# EAGLE schematic UCirKit30x20-0721 (EAGLE 7.3.0)
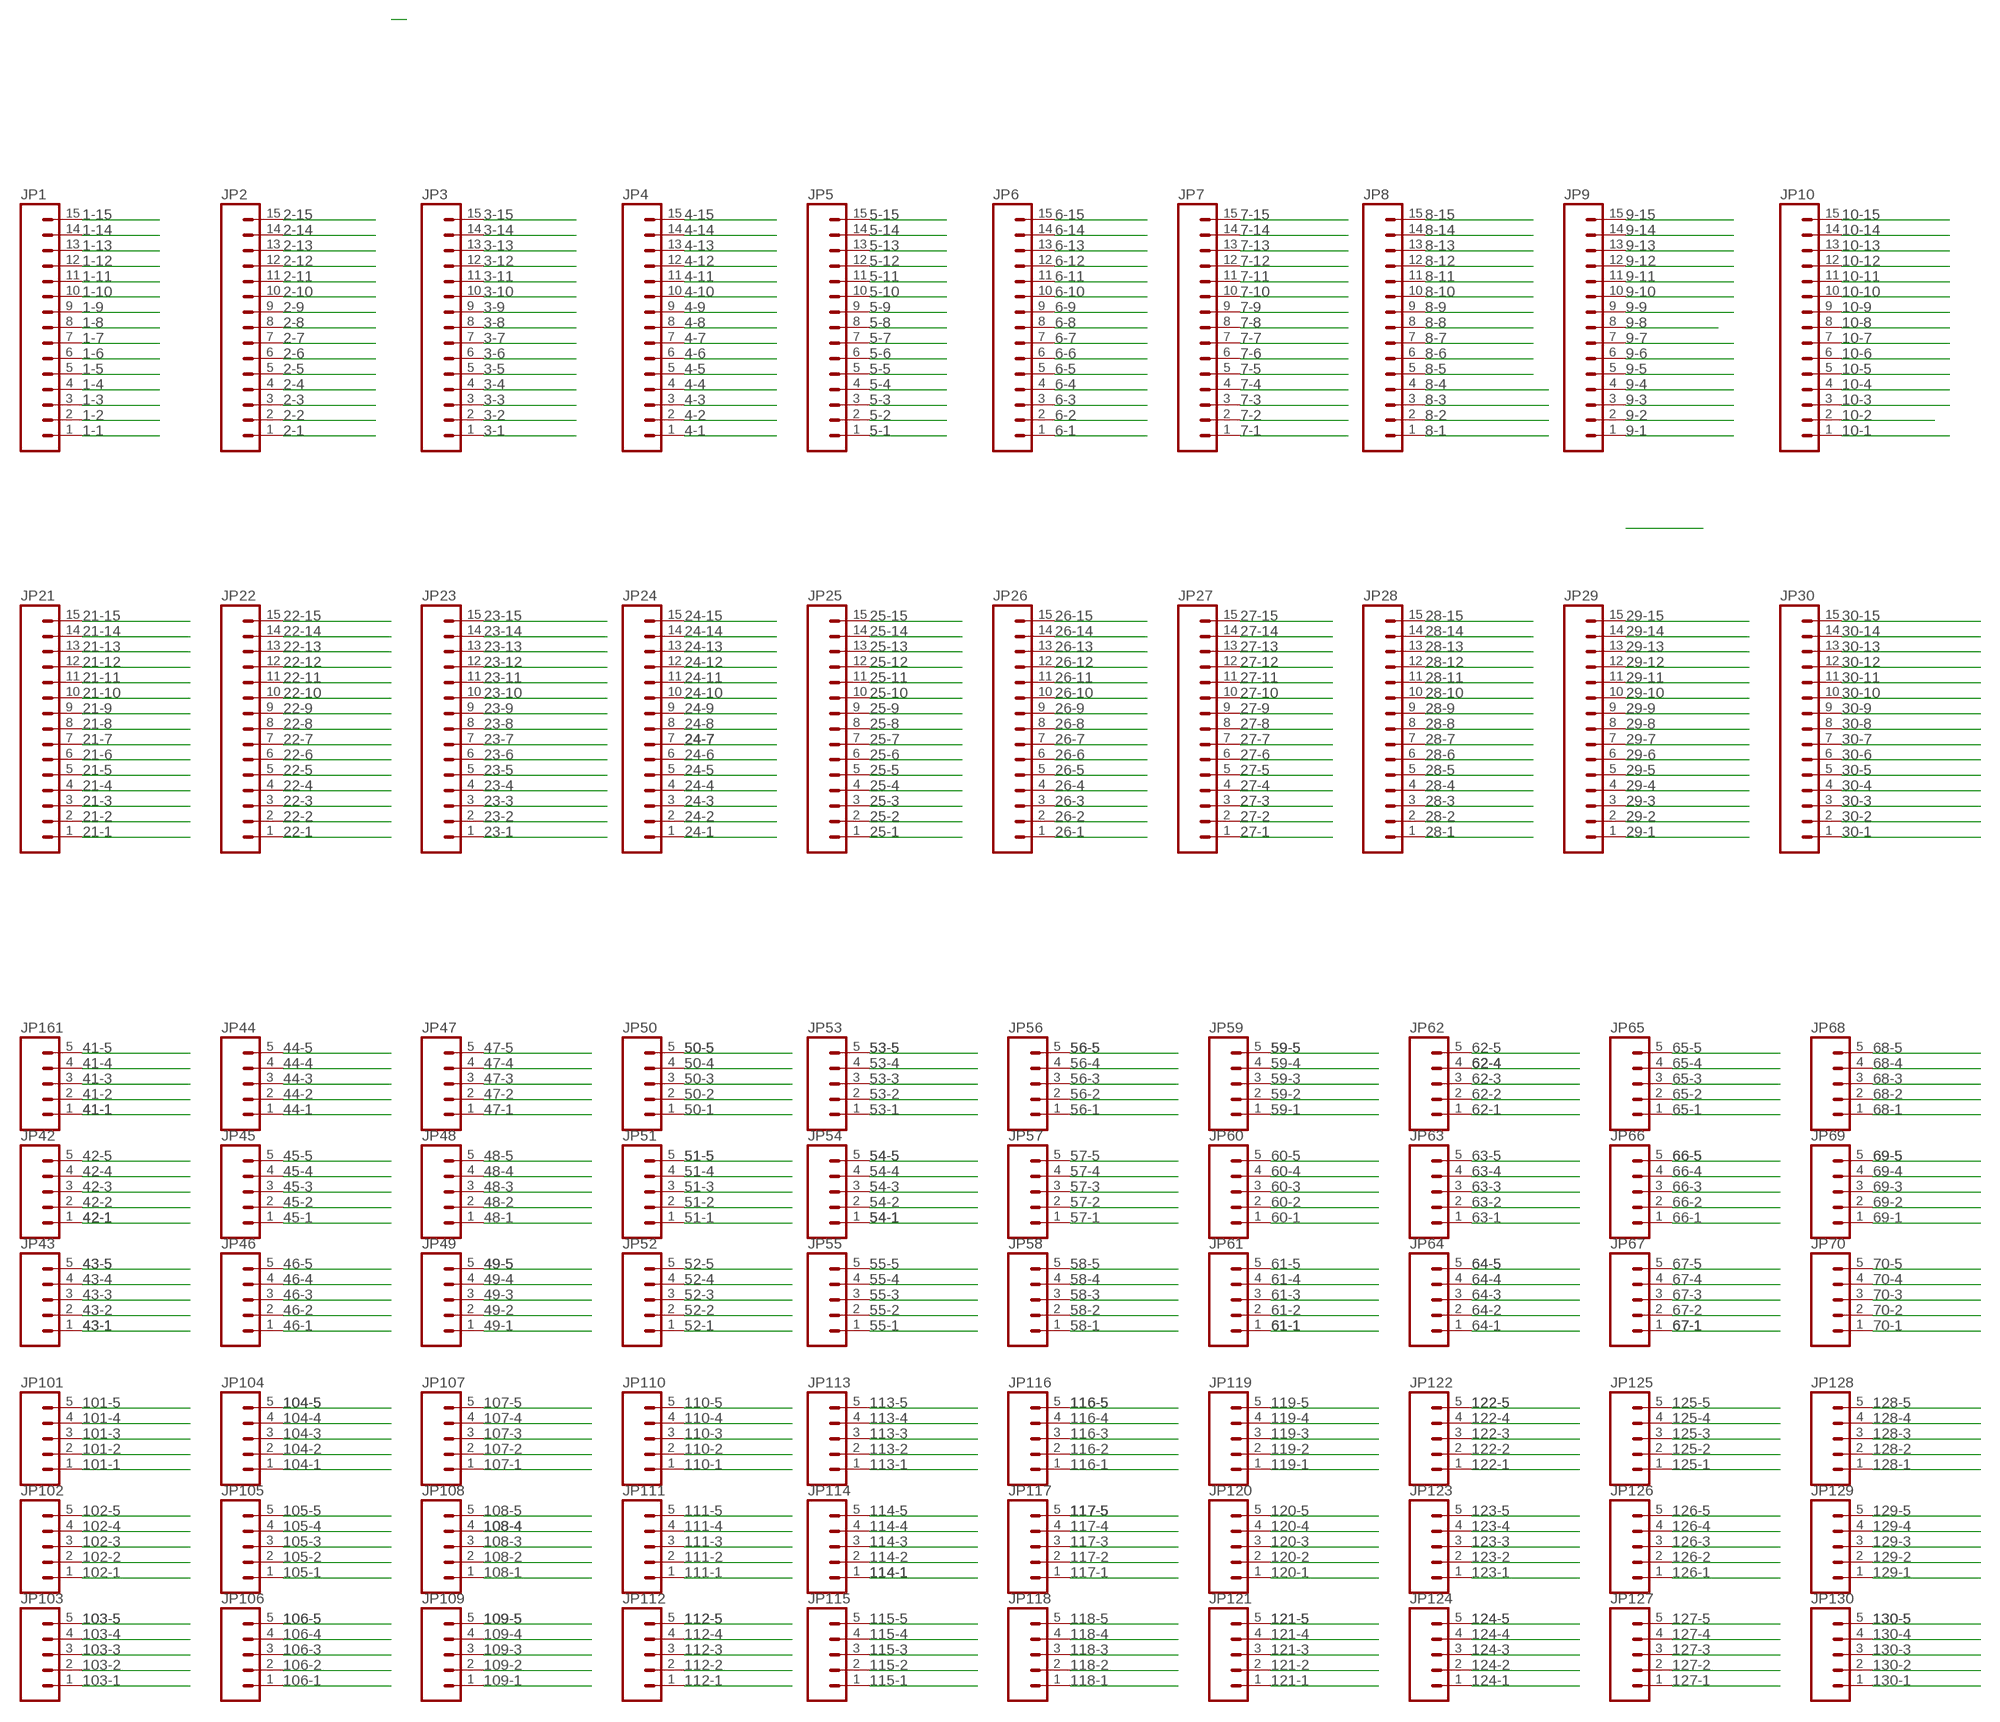
[diagram p0: schematic, sheet 1, part 1 of 2]
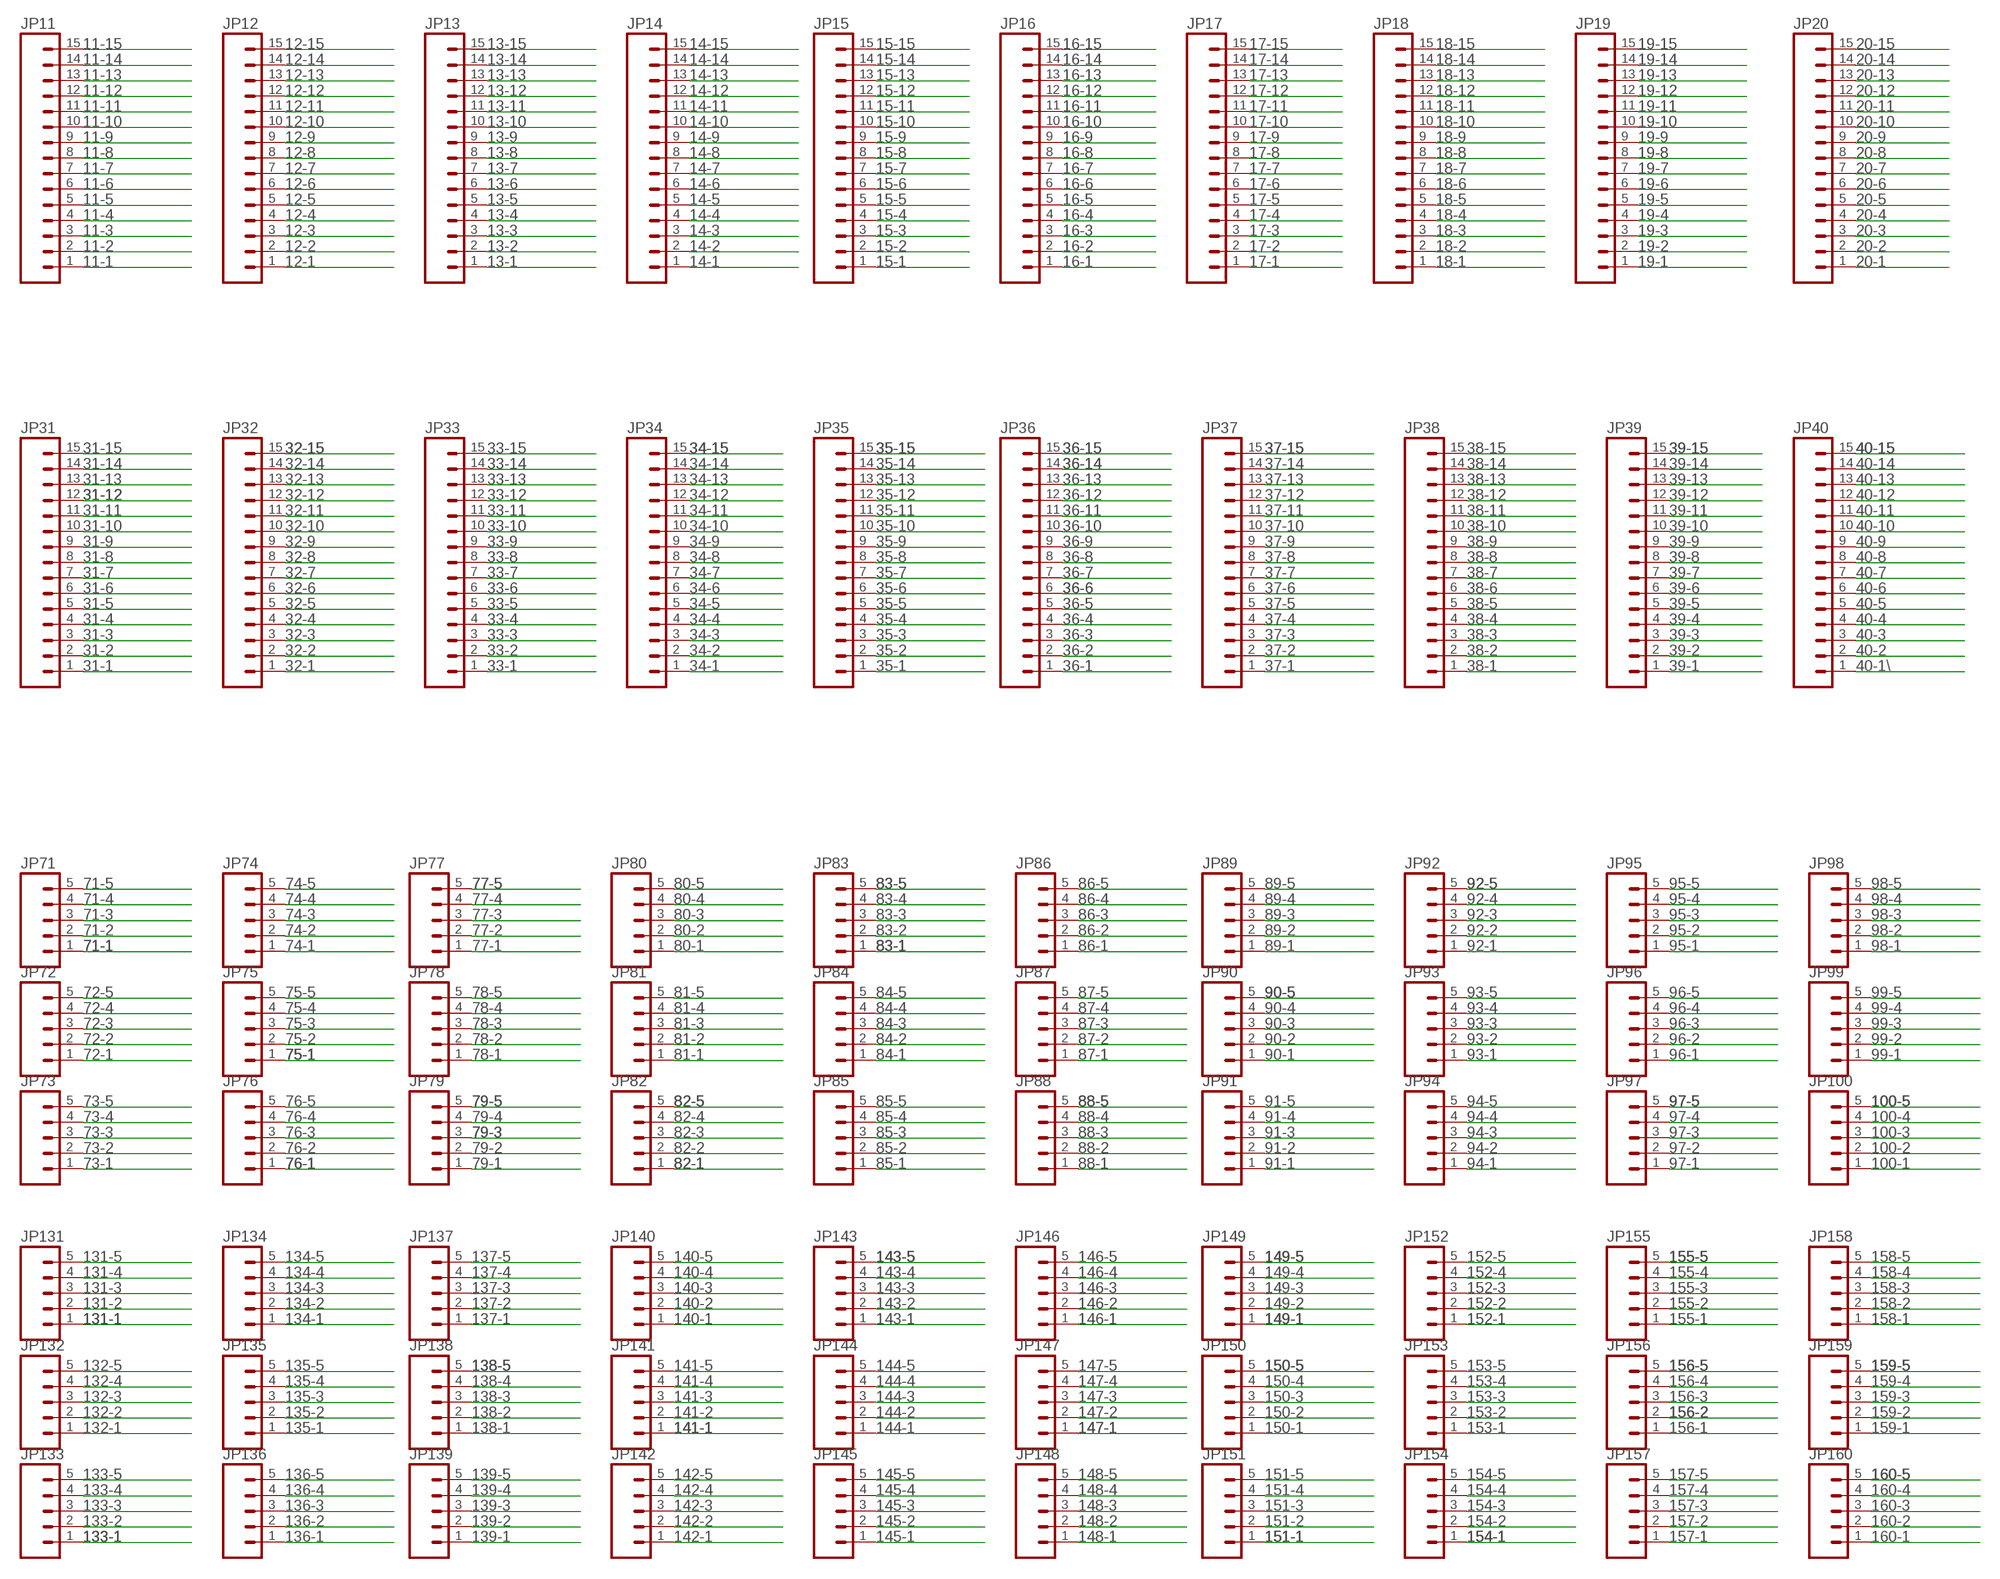
[diagram p1: schematic, sheet 1, part 2 of 2]

## Parts
JP1  M15  [1X15]
JP2  M15  [1X15]
JP3  M15  [1X15]
JP4  M15  [1X15]
JP5  M15  [1X15]
JP6  M15  [1X15]
JP7  M15  [1X15]
JP8  M15  [1X15]
JP9  M15  [1X15]
JP10  M15  [1X15]
JP11  M15  [1X15]
JP12  M15  [1X15]
JP13  M15  [1X15]
JP14  M15  [1X15]
JP15  M15  [1X15]
JP16  M15  [1X15]
JP17  M15  [1X15]
JP18  M15  [1X15]
JP19  M15  [1X15]
JP20  M15  [1X15]
JP21  M15  [1X15]
JP22  M15  [1X15]
JP23  M15  [1X15]
JP24  M15  [1X15]
JP25  M15  [1X15]
JP26  M15  [1X15]
JP27  M15  [1X15]
JP28  M15  [1X15]
JP29  M15  [1X15]
JP30  M15  [1X15]
JP31  M15  [1X15]
JP32  M15  [1X15]
JP33  M15  [1X15]
JP34  M15  [1X15]
JP35  M15  [1X15]
JP36  M15  [1X15]
JP37  M15  [1X15]
JP38  M15  [1X15]
JP39  M15  [1X15]
JP40  M15  [1X15]
JP42  M051.27MM  [1X05-1.27MM]
JP43  M051.27MM  [1X05-1.27MM]
JP44  M051.27MM  [1X05-1.27MM]
JP45  M051.27MM  [1X05-1.27MM]
JP46  M051.27MM  [1X05-1.27MM]
JP47  M051.27MM  [1X05-1.27MM]
JP48  M051.27MM  [1X05-1.27MM]
JP49  M051.27MM  [1X05-1.27MM]
JP50  M051.27MM  [1X05-1.27MM]
JP51  M051.27MM  [1X05-1.27MM]
JP52  M051.27MM  [1X05-1.27MM]
JP53  M051.27MM  [1X05-1.27MM]
JP54  M051.27MM  [1X05-1.27MM]
JP55  M051.27MM  [1X05-1.27MM]
JP56  M051.27MM  [1X05-1.27MM]
JP57  M051.27MM  [1X05-1.27MM]
JP58  M051.27MM  [1X05-1.27MM]
JP59  M051.27MM  [1X05-1.27MM]
JP60  M051.27MM  [1X05-1.27MM]
JP61  M051.27MM  [1X05-1.27MM]
JP62  M051.27MM  [1X05-1.27MM]
JP63  M051.27MM  [1X05-1.27MM]
JP64  M051.27MM  [1X05-1.27MM]
JP65  M051.27MM  [1X05-1.27MM]
JP66  M051.27MM  [1X05-1.27MM]
JP67  M051.27MM  [1X05-1.27MM]
JP68  M051.27MM  [1X05-1.27MM]
JP69  M051.27MM  [1X05-1.27MM]
JP70  M051.27MM  [1X05-1.27MM]
JP71  M051.27MM  [1X05-1.27MM]
JP72  M051.27MM  [1X05-1.27MM]
JP73  M051.27MM  [1X05-1.27MM]
JP74  M051.27MM  [1X05-1.27MM]
JP75  M051.27MM  [1X05-1.27MM]
JP76  M051.27MM  [1X05-1.27MM]
JP77  M051.27MM  [1X05-1.27MM]
JP78  M051.27MM  [1X05-1.27MM]
JP79  M051.27MM  [1X05-1.27MM]
JP80  M051.27MM  [1X05-1.27MM]
JP81  M051.27MM  [1X05-1.27MM]
JP82  M051.27MM  [1X05-1.27MM]
JP83  M051.27MM  [1X05-1.27MM]
JP84  M051.27MM  [1X05-1.27MM]
JP85  M051.27MM  [1X05-1.27MM]
JP86  M051.27MM  [1X05-1.27MM]
JP87  M051.27MM  [1X05-1.27MM]
JP88  M051.27MM  [1X05-1.27MM]
JP89  M051.27MM  [1X05-1.27MM]
JP90  M051.27MM  [1X05-1.27MM]
JP91  M051.27MM  [1X05-1.27MM]
JP92  M051.27MM  [1X05-1.27MM]
JP93  M051.27MM  [1X05-1.27MM]
JP94  M051.27MM  [1X05-1.27MM]
JP95  M051.27MM  [1X05-1.27MM]
JP96  M051.27MM  [1X05-1.27MM]
JP97  M051.27MM  [1X05-1.27MM]
JP98  M051.27MM  [1X05-1.27MM]
JP99  M051.27MM  [1X05-1.27MM]
JP100  M051.27MM  [1X05-1.27MM]
JP101  M051.27MM  [1X05-1.27MM]
JP102  M051.27MM  [1X05-1.27MM]
JP103  M051.27MM  [1X05-1.27MM]
JP104  M051.27MM  [1X05-1.27MM]
JP105  M051.27MM  [1X05-1.27MM]
JP106  M051.27MM  [1X05-1.27MM]
JP107  M051.27MM  [1X05-1.27MM]
JP108  M051.27MM  [1X05-1.27MM]
JP109  M051.27MM  [1X05-1.27MM]
JP110  M051.27MM  [1X05-1.27MM]
JP111  M051.27MM  [1X05-1.27MM]
JP112  M051.27MM  [1X05-1.27MM]
JP113  M051.27MM  [1X05-1.27MM]
JP114  M051.27MM  [1X05-1.27MM]
JP115  M051.27MM  [1X05-1.27MM]
JP116  M051.27MM  [1X05-1.27MM]
JP117  M051.27MM  [1X05-1.27MM]
JP118  M051.27MM  [1X05-1.27MM]
JP119  M051.27MM  [1X05-1.27MM]
JP120  M051.27MM  [1X05-1.27MM]
JP121  M051.27MM  [1X05-1.27MM]
JP122  M051.27MM  [1X05-1.27MM]
JP123  M051.27MM  [1X05-1.27MM]
JP124  M051.27MM  [1X05-1.27MM]
JP125  M051.27MM  [1X05-1.27MM]
JP126  M051.27MM  [1X05-1.27MM]
JP127  M051.27MM  [1X05-1.27MM]
JP128  M051.27MM  [1X05-1.27MM]
JP129  M051.27MM  [1X05-1.27MM]
JP130  M051.27MM  [1X05-1.27MM]
JP131  M051.27MM  [1X05-1.27MM]
JP132  M051.27MM  [1X05-1.27MM]
JP133  M051.27MM  [1X05-1.27MM]
JP134  M051.27MM  [1X05-1.27MM]
JP135  M051.27MM  [1X05-1.27MM]
JP136  M051.27MM  [1X05-1.27MM]
JP137  M051.27MM  [1X05-1.27MM]
JP138  M051.27MM  [1X05-1.27MM]
JP139  M051.27MM  [1X05-1.27MM]
JP140  M051.27MM  [1X05-1.27MM]
JP141  M051.27MM  [1X05-1.27MM]
JP142  M051.27MM  [1X05-1.27MM]
JP143  M051.27MM  [1X05-1.27MM]
JP144  M051.27MM  [1X05-1.27MM]
JP145  M051.27MM  [1X05-1.27MM]
JP146  M051.27MM  [1X05-1.27MM]
JP147  M051.27MM  [1X05-1.27MM]
JP148  M051.27MM  [1X05-1.27MM]
JP149  M051.27MM  [1X05-1.27MM]
JP150  M051.27MM  [1X05-1.27MM]
JP151  M051.27MM  [1X05-1.27MM]
JP152  M051.27MM  [1X05-1.27MM]
JP153  M051.27MM  [1X05-1.27MM]
JP154  M051.27MM  [1X05-1.27MM]
JP155  M051.27MM  [1X05-1.27MM]
JP156  M051.27MM  [1X05-1.27MM]
JP157  M051.27MM  [1X05-1.27MM]
JP158  M051.27MM  [1X05-1.27MM]
JP159  M051.27MM  [1X05-1.27MM]
JP160  M051.27MM  [1X05-1.27MM]
JP161  M051.27MM  [1X05-1.27MM]

## Nets
1-1: JP1.1
1-2: JP1.2
1-3: JP1.3
1-4: JP1.4
1-5: JP1.5
1-6: JP1.6
1-7: JP1.7
1-8: JP1.8
1-9: JP1.9
1-10: JP1.10
1-11: JP1.11
1-12: JP1.12
1-13: JP1.13
1-14: JP1.14
1-15: JP1.15
2-1: JP2.1
2-2: JP2.2
2-3: JP2.3
2-4: JP2.4
2-5: JP2.5
2-6: JP2.6
2-7: JP2.7
2-8: JP2.8
2-9: JP2.9
2-10: JP2.10
2-11: JP2.11
2-12: JP2.12
2-13: JP2.13
2-14: JP2.14
2-15: JP2.15
3-1: JP3.1
3-2: JP3.2
3-3: JP3.3
3-4: JP3.4
3-5: JP3.5
3-6: JP3.6
3-7: JP3.7
3-8: JP3.8
3-9: JP3.9
3-10: JP3.10
3-11: JP3.11
3-12: JP3.12
3-13: JP3.13
3-14: JP3.14
3-15: JP3.15
4-1: JP4.1
4-2: JP4.2
4-3: JP4.3
4-4: JP4.4
4-5: JP4.5
4-6: JP4.6
4-7: JP4.7
4-8: JP4.8
4-9: JP4.9
4-10: JP4.10
4-11: JP4.11
4-12: JP4.12
4-13: JP4.13
4-14: JP4.14
4-15: JP4.15
5-1: JP5.1
5-2: JP5.2
5-3: JP5.3
5-4: JP5.4
5-5: JP5.5
5-6: JP5.6
5-7: JP5.7
5-8: JP5.8
5-9: JP5.9
5-10: JP5.10
5-11: JP5.11
5-12: JP5.12
5-13: JP5.13
5-14: JP5.14
5-15: JP5.15
6-1: JP6.1
6-2: JP6.2
6-3: JP6.3
6-4: JP6.4
6-5: JP6.5
6-6: JP6.6
6-7: JP6.7
6-8: JP6.8
6-9: JP6.9
6-10: JP6.10
6-11: JP6.11
6-12: JP6.12
6-13: JP6.13
6-14: JP6.14
6-15: JP6.15
7-1: JP7.1
7-2: JP7.2
7-3: JP7.3
7-4: JP7.4
7-5: JP7.5
7-6: JP7.6
7-7: JP7.7
7-8: JP7.8
7-9: JP7.9
7-10: JP7.10
7-11: JP7.11
7-12: JP7.12
7-13: JP7.13
7-14: JP7.14
7-15: JP7.15
8-1: JP8.1
8-2: JP8.2
8-3: JP8.3
8-4: JP8.4
8-5: JP8.5
8-6: JP8.6
8-7: JP8.7
8-8: JP8.8
8-9: JP8.9
8-10: JP8.10
8-11: JP8.11
8-12: JP8.12
8-13: JP8.13
8-14: JP8.14
8-15: JP8.15
9-1: JP9.1
9-2: JP9.2
9-3: JP9.3
9-4: JP9.4
9-5: JP9.5
9-6: JP9.6
9-7: JP9.7
9-8: JP9.8
9-9: JP9.9
9-10: JP9.10
9-11: JP9.11
9-12: JP9.12
9-13: JP9.13
9-14: JP9.14
9-15: JP9.15
10-1: JP10.1
10-2: JP10.2
10-3: JP10.3
10-4: JP10.4
10-5: JP10.5
10-6: JP10.6
10-7: JP10.7
10-8: JP10.8
10-9: JP10.9
10-10: JP10.10
10-11: JP10.11
10-12: JP10.12
10-13: JP10.13
10-14: JP10.14
10-15: JP10.15
11-1: JP11.1
11-2: JP11.2
11-3: JP11.3
11-4: JP11.4
11-5: JP11.5
11-6: JP11.6
11-7: JP11.7
11-8: JP11.8
11-9: JP11.9
11-10: JP11.10
11-11: JP11.11
11-12: JP11.12
11-13: JP11.13
11-14: JP11.14
11-15: JP11.15
12-1: JP12.1
12-2: JP12.2
12-3: JP12.3
12-4: JP12.4
12-5: JP12.5
12-6: JP12.6
12-7: JP12.7
12-8: JP12.8
12-9: JP12.9
12-10: JP12.10
12-11: JP12.11
12-12: JP12.12
12-13: JP12.13
12-14: JP12.14
12-15: JP12.15
13-1: JP13.1
13-2: JP13.2
13-3: JP13.3
13-4: JP13.4
13-5: JP13.5
13-6: JP13.6
13-7: JP13.7
13-8: JP13.8
13-9: JP13.9
13-10: JP13.10
13-11: JP13.11
13-12: JP13.12
13-13: JP13.13
13-14: JP13.14
14-1: JP14.1
14-2: JP14.2
14-3: JP14.3
14-4: JP14.4
14-5: JP14.5
14-6: JP14.6
14-7: JP14.7
14-8: JP14.8
14-9: JP14.9
14-10: JP14.10
14-11: JP14.11
14-12: JP14.12
14-13: JP14.13
14-14: JP14.14
14-15: JP14.15
15-1: JP15.1
15-2: JP15.2
15-3: JP15.3
15-4: JP15.4
15-5: JP15.5
15-6: JP15.6
15-7: JP15.7
15-8: JP15.8
15-9: JP15.9
15-10: JP15.10
15-11: JP15.11
15-12: JP15.12
15-13: JP15.13
15-14: JP15.14
15-15: JP15.15
16-1: JP16.1
16-2: JP16.2
16-3: JP16.3
16-4: JP16.4
16-5: JP16.5
16-6: JP16.6
16-7: JP16.7
16-8: JP16.8
16-9: JP16.9
16-10: JP16.10
16-11: JP16.11
16-12: JP16.12
16-13: JP16.13
16-14: JP16.14
16-15: JP16.15
17-1: JP17.1
17-2: JP17.2
17-3: JP17.3
17-4: JP17.4
17-5: JP17.5
17-6: JP17.6
17-7: JP17.7
17-8: JP17.8
17-9: JP17.9
17-10: JP17.10
17-11: JP17.11
17-12: JP17.12
17-13: JP17.13
17-14: JP17.14
17-15: JP17.15
18-1: JP18.1
18-2: JP18.2
18-3: JP18.3
18-4: JP18.4
18-5: JP18.5
18-6: JP18.6
18-7: JP18.7
18-8: JP18.8
18-9: JP18.9
18-10: JP18.10
18-11: JP18.11
18-12: JP18.12
18-13: JP18.13
18-14: JP18.14
18-15: JP18.15
19-1: JP19.1
19-2: JP19.2
19-3: JP19.3
19-4: JP19.4
19-5: JP19.5
19-6: JP19.6
19-7: JP19.7
19-8: JP19.8
19-9: JP19.9
19-10: JP19.10
19-11: JP19.11
19-12: JP19.12
19-13: JP19.13
19-14: JP19.14
19-15: JP19.15
20-1: JP20.1
20-2: JP20.2
20-3: JP20.3
20-4: JP20.4
20-5: JP20.5
20-6: JP20.6
20-7: JP20.7
20-8: JP20.8
20-9: JP20.9
20-10: JP20.10
20-11: JP20.11
20-12: JP20.12
20-13: JP20.13
20-14: JP20.14
20-15: JP20.15
21-1: JP21.1
21-2: JP21.2
21-3: JP21.3
21-4: JP21.4
21-5: JP21.5
21-6: JP21.6
21-7: JP21.7
21-8: JP21.8
21-9: JP21.9
21-10: JP21.10
21-11: JP21.11
21-12: JP21.12
21-13: JP21.13
21-14: JP21.14
21-15: JP21.15
22-1: JP22.1
22-2: JP22.2
22-3: JP22.3
22-4: JP22.4
22-5: JP22.5
22-6: JP22.6
22-7: JP22.7
22-8: JP22.8
22-9: JP22.9
22-10: JP22.10
22-11: JP22.11
22-12: JP22.12
22-13: JP22.13
22-14: JP22.14
22-15: JP22.15
23-1: JP23.1
23-2: JP23.2
23-3: JP23.3
23-4: JP23.4
23-5: JP23.5
23-6: JP23.6
23-7: JP23.7
23-8: JP23.8
23-9: JP23.9
23-10: JP23.10
23-11: JP23.11
23-12: JP23.12
23-13: JP23.13
23-14: JP23.14
23-15: JP23.15
24-1: JP24.1
24-2: JP24.2
24-3: JP24.3
24-4: JP24.4
24-5: JP24.5
24-6: JP24.6
24-7: JP24.7
24-8: JP24.8
24-9: JP24.9
24-10: JP24.10
24-11: JP24.11
24-12: JP24.12
24-13: JP24.13
24-14: JP24.14
24-15: JP24.15
25-1: JP25.1
25-2: JP25.2
25-3: JP25.3
25-4: JP25.4
25-5: JP25.5
25-6: JP25.6
25-7: JP25.7
25-8: JP25.8
25-9: JP25.9
25-10: JP25.10
25-11: JP25.11
25-12: JP25.12
25-13: JP25.13
25-14: JP25.14
25-15: JP25.15
26-1: JP26.1
26-2: JP26.2
26-3: JP26.3
26-4: JP26.4
26-5: JP26.5
26-6: JP26.6
26-7: JP26.7
26-8: JP26.8
26-9: JP26.9
26-10: JP26.10
26-11: JP26.11
26-12: JP26.12
26-13: JP26.13
26-14: JP26.14
26-15: JP26.15
27-1: JP27.1
27-2: JP27.2
27-3: JP27.3
27-4: JP27.4
27-5: JP27.5
27-6: JP27.6
27-7: JP27.7
27-8: JP27.8
27-9: JP27.9
27-10: JP27.10
27-11: JP27.11
27-12: JP27.12
27-13: JP27.13
27-14: JP27.14
27-15: JP27.15
28-1: JP28.1
28-2: JP28.2
28-3: JP28.3
28-4: JP28.4
28-5: JP28.5
28-6: JP28.6
28-7: JP28.7
28-8: JP28.8
28-9: JP28.9
28-10: JP28.10
28-11: JP28.11
28-12: JP28.12
28-13: JP28.13
28-14: JP28.14
28-15: JP28.15
29-1: JP29.1
29-2: JP29.2
29-3: JP29.3
29-4: JP29.4
29-5: JP29.5
29-6: JP29.6
29-7: JP29.7
29-8: JP29.8
29-9: JP29.9
29-10: JP29.10
29-11: JP29.11
29-12: JP29.12
29-13: JP29.13
29-14: JP29.14
29-15: JP29.15
30-1: JP30.1
30-2: JP30.2
30-3: JP30.3
30-4: JP30.4
30-5: JP30.5
30-6: JP30.6
30-7: JP30.7
30-8: JP30.8
30-9: JP30.9
30-10: JP30.10
30-11: JP30.11
30-12: JP30.12
30-13: JP30.13
30-14: JP30.14
30-15: JP30.15
31-1: JP31.1
31-2: JP31.2
31-3: JP31.3
31-4: JP31.4
31-5: JP31.5
31-6: JP31.6
31-7: JP31.7
31-8: JP31.8
31-9: JP31.9
31-10: JP31.10
31-11: JP31.11
31-12: JP31.12
31-13: JP31.13
31-14: JP31.14
31-15: JP31.15
32-1: JP32.1
32-2: JP32.2
32-3: JP32.3
32-4: JP32.4
32-5: JP32.5
32-6: JP32.6
32-7: JP32.7
32-8: JP32.8
32-9: JP32.9
32-10: JP32.10
32-11: JP32.11
32-12: JP32.12
32-13: JP32.13
32-14: JP32.14
32-15: JP32.15
33-1: JP33.1
33-2: JP33.2
33-3: JP33.3
33-4: JP33.4
33-5: JP33.5
33-6: JP33.6
33-7: JP33.7
33-8: JP33.8
33-9: JP33.9
33-10: JP33.10
33-11: JP33.11
33-12: JP33.12
33-13: JP33.13
33-14: JP33.14
33-15: JP33.15
34-1: JP34.1
34-2: JP34.2
34-3: JP34.3
34-4: JP34.4
34-5: JP34.5
34-6: JP34.6
34-7: JP34.7
34-8: JP34.8
34-9: JP34.9
34-10: JP34.10
34-11: JP34.11
34-12: JP34.12
34-13: JP34.13
34-14: JP34.14
34-15: JP34.15
35-1: JP35.1
35-2: JP35.2
35-3: JP35.3
35-4: JP35.4
35-5: JP35.5
35-6: JP35.6
35-7: JP35.7
35-8: JP35.8
35-9: JP35.9
35-10: JP35.10
35-11: JP35.11
35-12: JP35.12
35-13: JP35.13
35-14: JP35.14
35-15: JP35.15
36-1: JP36.1
36-2: JP36.2
36-3: JP36.3
36-4: JP36.4
36-5: JP36.5
36-6: JP36.6
36-7: JP36.7
36-8: JP36.8
36-9: JP36.9
36-10: JP36.10
36-11: JP36.11
36-12: JP36.12
36-13: JP36.13
36-14: JP36.14
36-15: JP36.15
37-1: JP37.1
37-2: JP37.2
37-3: JP37.3
37-4: JP37.4
37-5: JP37.5
37-6: JP37.6
37-7: JP37.7
37-8: JP37.8
37-9: JP37.9
37-10: JP37.10
37-11: JP37.11
37-12: JP37.12
37-13: JP37.13
37-14: JP37.14
37-15: JP37.15
38-1: JP38.1
38-2: JP38.2
38-3: JP38.3
38-4: JP38.4
38-5: JP38.5
38-6: JP38.6
38-7: JP38.7
38-8: JP38.8
38-9: JP38.9
38-10: JP38.10
38-11: JP38.11
38-12: JP38.12
38-13: JP38.13
38-14: JP38.14
38-15: JP38.15
39-1: JP39.1
39-2: JP39.2
39-3: JP39.3
39-4: JP39.4
39-5: JP39.5
39-6: JP39.6
39-7: JP39.7
39-8: JP39.8
39-9: JP39.9
39-10: JP39.10
39-11: JP39.11
39-12: JP39.12
39-13: JP39.13
39-14: JP39.14
39-15: JP39.15
40-1\: JP40.1
40-2: JP40.2
40-3: JP40.3
40-4: JP40.4
40-5: JP40.5
40-6: JP40.6
40-7: JP40.7
40-8: JP40.8
40-9: JP40.9
40-10: JP40.10
40-11: JP40.11
40-12: JP40.12
40-13: JP40.13
40-14: JP40.14
40-15: JP40.15
41-1: JP161.1
41-2: JP161.2
41-3: JP161.3
41-4: JP161.4
41-5: JP161.5
42-1: JP42.1
42-2: JP42.2
42-3: JP42.3
42-4: JP42.4
42-5: JP42.5
43-1: JP43.1
43-2: JP43.2
43-3: JP43.3
43-4: JP43.4
43-5: JP43.5
44-1: JP44.1
44-2: JP44.2
44-3: JP44.3
44-4: JP44.4
44-5: JP44.5
45-1: JP45.1
45-2: JP45.2
45-3: JP45.3
45-4: JP45.4
45-5: JP45.5
46-1: JP46.1
46-2: JP46.2
46-3: JP46.3
46-4: JP46.4
46-5: JP46.5
47-1: JP47.1
47-2: JP47.2
47-3: JP47.3
47-4: JP47.4
47-5: JP47.5
48-1: JP48.1
48-2: JP48.2
48-3: JP48.3
48-4: JP48.4
48-5: JP48.5
49-1: JP49.1
49-2: JP49.2
49-3: JP49.3
49-4: JP49.4
49-5: JP49.5
50-1: JP50.1
50-2: JP50.2
50-3: JP50.3
50-4: JP50.4
50-5: JP50.5
51-1: JP51.1
51-2: JP51.2
51-3: JP51.3
51-4: JP51.4
51-5: JP51.5
52-1: JP52.1
52-2: JP52.2
52-3: JP52.3
52-4: JP52.4
52-5: JP52.5
53-1: JP53.1
53-2: JP53.2
53-3: JP53.3
53-4: JP53.4
53-5: JP53.5
54-1: JP54.1
54-2: JP54.2
54-3: JP54.3
54-4: JP54.4
54-5: JP54.5
55-1: JP55.1
55-2: JP55.2
55-3: JP55.3
55-4: JP55.4
55-5: JP55.5
56-1: JP56.1
56-2: JP56.2
56-3: JP56.3
56-4: JP56.4
56-5: JP56.5
57-1: JP57.1
57-2: JP57.2
57-3: JP57.3
57-4: JP57.4
57-5: JP57.5
58-1: JP58.1
58-2: JP58.2
58-3: JP58.3
58-4: JP58.4
58-5: JP58.5
59-1: JP59.1
59-2: JP59.2
59-3: JP59.3
59-4: JP59.4
59-5: JP59.5
60-1: JP60.1
60-2: JP60.2
60-3: JP60.3
60-4: JP60.4
60-5: JP60.5
61-1: JP61.1
61-2: JP61.2
61-3: JP61.3
61-4: JP61.4
61-5: JP61.5
62-1: JP62.1
62-2: JP62.2
62-3: JP62.3
62-4: JP62.4
62-5: JP62.5
63-1: JP63.1
63-2: JP63.2
63-3: JP63.3
63-4: JP63.4
63-5: JP63.5
64-1: JP64.1
64-2: JP64.2
64-3: JP64.3
64-4: JP64.4
64-5: JP64.5
65-1: JP65.1
65-2: JP65.2
65-3: JP65.3
65-4: JP65.4
65-5: JP65.5
66-1: JP66.1
66-2: JP66.2
66-3: JP66.3
66-4: JP66.4
66-5: JP66.5
67-1: JP67.1
67-2: JP67.2
67-3: JP67.3
67-4: JP67.4
67-5: JP67.5
68-1: JP68.1
68-2: JP68.2
68-3: JP68.3
68-4: JP68.4
68-5: JP68.5
69-1: JP69.1
69-2: JP69.2
69-3: JP69.3
69-4: JP69.4
69-5: JP69.5
70-1: JP70.1
70-2: JP70.2
70-3: JP70.3
70-4: JP70.4
70-5: JP70.5
71-1: JP71.1
71-2: JP71.2
71-3: JP71.3
71-4: JP71.4
71-5: JP71.5
72-1: JP72.1
72-2: JP72.2
72-3: JP72.3
72-4: JP72.4
72-5: JP72.5
73-1: JP73.1
73-2: JP73.2
73-3: JP73.3
73-4: JP73.4
73-5: JP73.5
74-1: JP74.1
74-2: JP74.2
74-3: JP74.3
74-4: JP74.4
74-5: JP74.5
75-1: JP75.1
75-2: JP75.2
75-3: JP75.3
75-4: JP75.4
75-5: JP75.5
76-1: JP76.1
76-2: JP76.2
76-3: JP76.3
76-4: JP76.4
76-5: JP76.5
77-1: JP77.1
77-2: JP77.2
77-3: JP77.3
77-4: JP77.4
77-5: JP77.5
78-1: JP78.1
78-2: JP78.2
78-3: JP78.3
78-4: JP78.4
78-5: JP78.5
79-1: JP79.1
79-2: JP79.2
79-3: JP79.3
79-4: JP79.4
79-5: JP79.5
80-1: JP80.1
80-2: JP80.2
80-3: JP80.3
80-4: JP80.4
80-5: JP80.5
81-1: JP81.1
81-2: JP81.2
81-3: JP81.3
81-4: JP81.4
81-5: JP81.5
82-1: JP82.1
82-2: JP82.2
82-3: JP82.3
82-4: JP82.4
82-5: JP82.5
83-1: JP83.1
83-2: JP83.2
83-3: JP83.3
83-4: JP83.4
83-5: JP83.5
84-1: JP84.1
84-2: JP84.2
84-3: JP84.3
84-4: JP84.4
84-5: JP84.5
85-1: JP85.1
85-2: JP85.2
85-3: JP85.3
85-4: JP85.4
85-5: JP85.5
86-1: JP86.1
86-2: JP86.2
86-3: JP86.3
86-4: JP86.4
86-5: JP86.5
87-1: JP87.1
87-2: JP87.2
87-3: JP87.3
87-4: JP87.4
87-5: JP87.5
88-1: JP88.1
88-2: JP88.2
88-3: JP88.3
88-4: JP88.4
88-5: JP88.5
89-1: JP89.1
89-2: JP89.2
89-3: JP89.3
89-4: JP89.4
89-5: JP89.5
90-1: JP90.1
90-2: JP90.2
90-3: JP90.3
90-4: JP90.4
90-5: JP90.5
91-1: JP91.1
91-2: JP91.2
91-3: JP91.3
91-4: JP91.4
91-5: JP91.5
92-1: JP92.1
92-2: JP92.2
92-3: JP92.3
92-4: JP92.4
92-5: JP92.5
93-1: JP93.1
93-2: JP93.2
93-3: JP93.3
93-4: JP93.4
93-5: JP93.5
94-1: JP94.1
94-2: JP94.2
94-3: JP94.3
94-4: JP94.4
94-5: JP94.5
95-1: JP95.1
95-2: JP95.2
95-3: JP95.3
95-4: JP95.4
95-5: JP95.5
96-1: JP96.1
96-2: JP96.2
96-3: JP96.3
96-4: JP96.4
96-5: JP96.5
97-1: JP97.1
97-2: JP97.2
97-3: JP97.3
97-4: JP97.4
97-5: JP97.5
98-1: JP98.1
98-2: JP98.2
98-3: JP98.3
98-4: JP98.4
98-5: JP98.5
99-1: JP99.1
99-2: JP99.2
99-3: JP99.3
99-4: JP99.4
99-5: JP99.5
100-1: JP100.1
100-2: JP100.2
100-3: JP100.3
100-4: JP100.4
100-5: JP100.5
101-1: JP101.1
101-2: JP101.2
101-3: JP101.3
101-4: JP101.4
101-5: JP101.5
102-1: JP102.1
102-2: JP102.2
102-3: JP102.3
102-4: JP102.4
102-5: JP102.5
103-1: JP103.1
103-2: JP103.2
103-3: JP103.3
103-4: JP103.4
103-5: JP103.5
104-1: JP104.1
104-2: JP104.2
104-3: JP104.3
104-4: JP104.4
104-5: JP104.5
105-1: JP105.1
105-2: JP105.2
105-3: JP105.3
105-4: JP105.4
105-5: JP105.5
106-1: JP106.1
106-2: JP106.2
106-3: JP106.3
106-4: JP106.4
106-5: JP106.5
107-1: JP107.1
107-2: JP107.2
107-3: JP107.3
107-4: JP107.4
107-5: JP107.5
108-1: JP108.1
108-2: JP108.2
108-3: JP108.3
108-4: JP108.4
108-5: JP108.5
109-1: JP109.1
109-2: JP109.2
109-3: JP109.3
109-4: JP109.4
109-5: JP109.5
110-1: JP110.1
110-2: JP110.2
110-3: JP110.3
110-4: JP110.4
110-5: JP110.5
111-1: JP111.1
111-2: JP111.2
111-3: JP111.3
111-4: JP111.4
111-5: JP111.5
112-1: JP112.1
112-2: JP112.2
112-3: JP112.3
112-4: JP112.4
112-5: JP112.5
113-1: JP113.1
113-2: JP113.2
113-3: JP113.3
113-4: JP113.4
113-5: JP113.5
114-1: JP114.1
114-2: JP114.2
114-3: JP114.3
114-4: JP114.4
114-5: JP114.5
115-1: JP115.1
115-2: JP115.2
115-3: JP115.3
115-4: JP115.4
115-5: JP115.5
116-1: JP116.1
116-2: JP116.2
116-3: JP116.3
116-4: JP116.4
116-5: JP116.5
117-1: JP117.1
117-2: JP117.2
117-3: JP117.3
117-4: JP117.4
117-5: JP117.5
118-1: JP118.1
118-2: JP118.2
118-3: JP118.3
118-4: JP118.4
118-5: JP118.5
119-1: JP119.1
119-2: JP119.2
119-3: JP119.3
119-4: JP119.4
119-5: JP119.5
120-1: JP120.1
120-2: JP120.2
120-3: JP120.3
120-4: JP120.4
120-5: JP120.5
121-1: JP121.1
121-2: JP121.2
121-3: JP121.3
121-4: JP121.4
121-5: JP121.5
122-1: JP122.1
122-2: JP122.2
122-3: JP122.3
122-4: JP122.4
122-5: JP122.5
123-1: JP123.1
123-2: JP123.2
123-3: JP123.3
123-4: JP123.4
123-5: JP123.5
124-1: JP124.1
124-2: JP124.2
124-3: JP124.3
124-4: JP124.4
124-5: JP124.5
125-1: JP125.1
125-2: JP125.2
125-3: JP125.3
125-4: JP125.4
125-5: JP125.5
126-1: JP126.1
126-2: JP126.2
126-3: JP126.3
126-4: JP126.4
126-5: JP126.5
127-1: JP127.1
127-2: JP127.2
127-3: JP127.3
127-4: JP127.4
127-5: JP127.5
128-1: JP128.1
128-2: JP128.2
128-3: JP128.3
128-4: JP128.4
128-5: JP128.5
129-1: JP129.1
129-2: JP129.2
129-3: JP129.3
129-4: JP129.4
129-5: JP129.5
130-1: JP130.1
130-2: JP130.2
130-3: JP130.3
130-4: JP130.4
130-5: JP130.5
131-1: JP131.1
131-2: JP131.2
131-3: JP131.3
131-4: JP131.4
131-5: JP131.5
132-1: JP132.1
132-2: JP132.2
132-3: JP132.3
132-4: JP132.4
132-5: JP132.5
133-1: JP133.1
133-2: JP133.2
133-3: JP133.3
133-4: JP133.4
133-5: JP133.5
134-1: JP134.1
134-2: JP134.2
134-3: JP134.3
134-4: JP134.4
134-5: JP134.5
135-1: JP135.1
135-2: JP135.2
135-3: JP135.3
135-4: JP135.4
135-5: JP135.5
136-1: JP136.1
136-2: JP136.2
136-3: JP136.3
136-4: JP136.4
136-5: JP136.5
137-1: JP137.1
137-2: JP137.2
137-3: JP137.3
137-4: JP137.4
137-5: JP137.5
138-1: JP138.1
138-2: JP138.2
138-3: JP138.3
138-4: JP138.4
138-5: JP138.5
139-1: JP139.1
139-2: JP139.2
139-3: JP139.3
139-4: JP139.4
139-5: JP139.5
140-1: JP140.1
140-2: JP140.2
140-3: JP140.3
140-4: JP140.4
140-5: JP140.5
141-1: JP141.1
141-2: JP141.2
141-3: JP141.3
141-4: JP141.4
141-5: JP141.5
142-1: JP142.1
142-2: JP142.2
142-3: JP142.3
142-4: JP142.4
142-5: JP142.5
143-1: JP143.1
143-2: JP143.2
143-3: JP143.3
143-4: JP143.4
143-5: JP143.5
144-1: JP144.1
144-2: JP144.2
144-3: JP144.3
144-4: JP144.4
144-5: JP144.5
145-1: JP145.1
145-2: JP145.2
145-3: JP145.3
145-4: JP145.4
145-5: JP145.5
146-1: JP146.1
146-2: JP146.2
146-3: JP146.3
146-4: JP146.4
146-5: JP146.5
147-1: JP147.1
147-2: JP147.2
147-3: JP147.3
147-4: JP147.4
147-5: JP147.5
148-1: JP148.1
148-2: JP148.2
148-3: JP148.3
148-4: JP148.4
148-5: JP148.5
149-1: JP149.1
149-2: JP149.2
149-3: JP149.3
149-4: JP149.4
149-5: JP149.5
150-1: JP150.1
150-2: JP150.2
150-3: JP150.3
150-4: JP150.4
150-5: JP150.5
151-1: JP151.1
151-2: JP151.2
151-3: JP151.3
151-4: JP151.4
151-5: JP151.5
152-1: JP152.1
152-2: JP152.2
152-3: JP152.3
152-4: JP152.4
152-5: JP152.5
153-1: JP153.1
153-2: JP153.2
153-3: JP153.3
153-4: JP153.4
153-5: JP153.5
154-1: JP154.1
154-2: JP154.2
154-3: JP154.3
154-4: JP154.4
154-5: JP154.5
155-1: JP155.1
155-2: JP155.2
155-3: JP155.3
155-4: JP155.4
155-5: JP155.5
156-1: JP156.1
156-2: JP156.2
156-3: JP156.3
156-4: JP156.4
156-5: JP156.5
157-1: JP157.1
157-2: JP157.2
157-3: JP157.3
157-4: JP157.4
157-5: JP157.5
158-1: JP158.1
158-2: JP158.2
158-3: JP158.3
158-4: JP158.4
158-5: JP158.5
159-1: JP159.1
159-2: JP159.2
159-3: JP159.3
159-4: JP159.4
159-5: JP159.5
160-1: JP160.1
160-2: JP160.2
160-3: JP160.3
160-4: JP160.4
160-5: JP160.5
Unconnected: JP13.15

## Library data of the parts
JP1-JP40 = SparkFun-Connectors:M15: Header 15 Standard 15-pin 0.1" header. Use with straight break away headers (SKU : PRT-00116), right angle break away headers (PRT-00553), swiss pins (PRT-00743), machine pins (PRT-00117), and female headers (PRT-00115).
JP42-JP161 = SparkFun-Connectors:M05: Header 5 Standard 5-pin 0.1" header. Use with straight break away headers (SKU : PRT-00116), right angle break away headers (PRT-00553), swiss pins (PRT-00743), machine pins (PRT-00117), and female headers (PRT-00115). Molex polarized connector foot print use with SKU : PRT-08230 with associated crimp pins and housings.